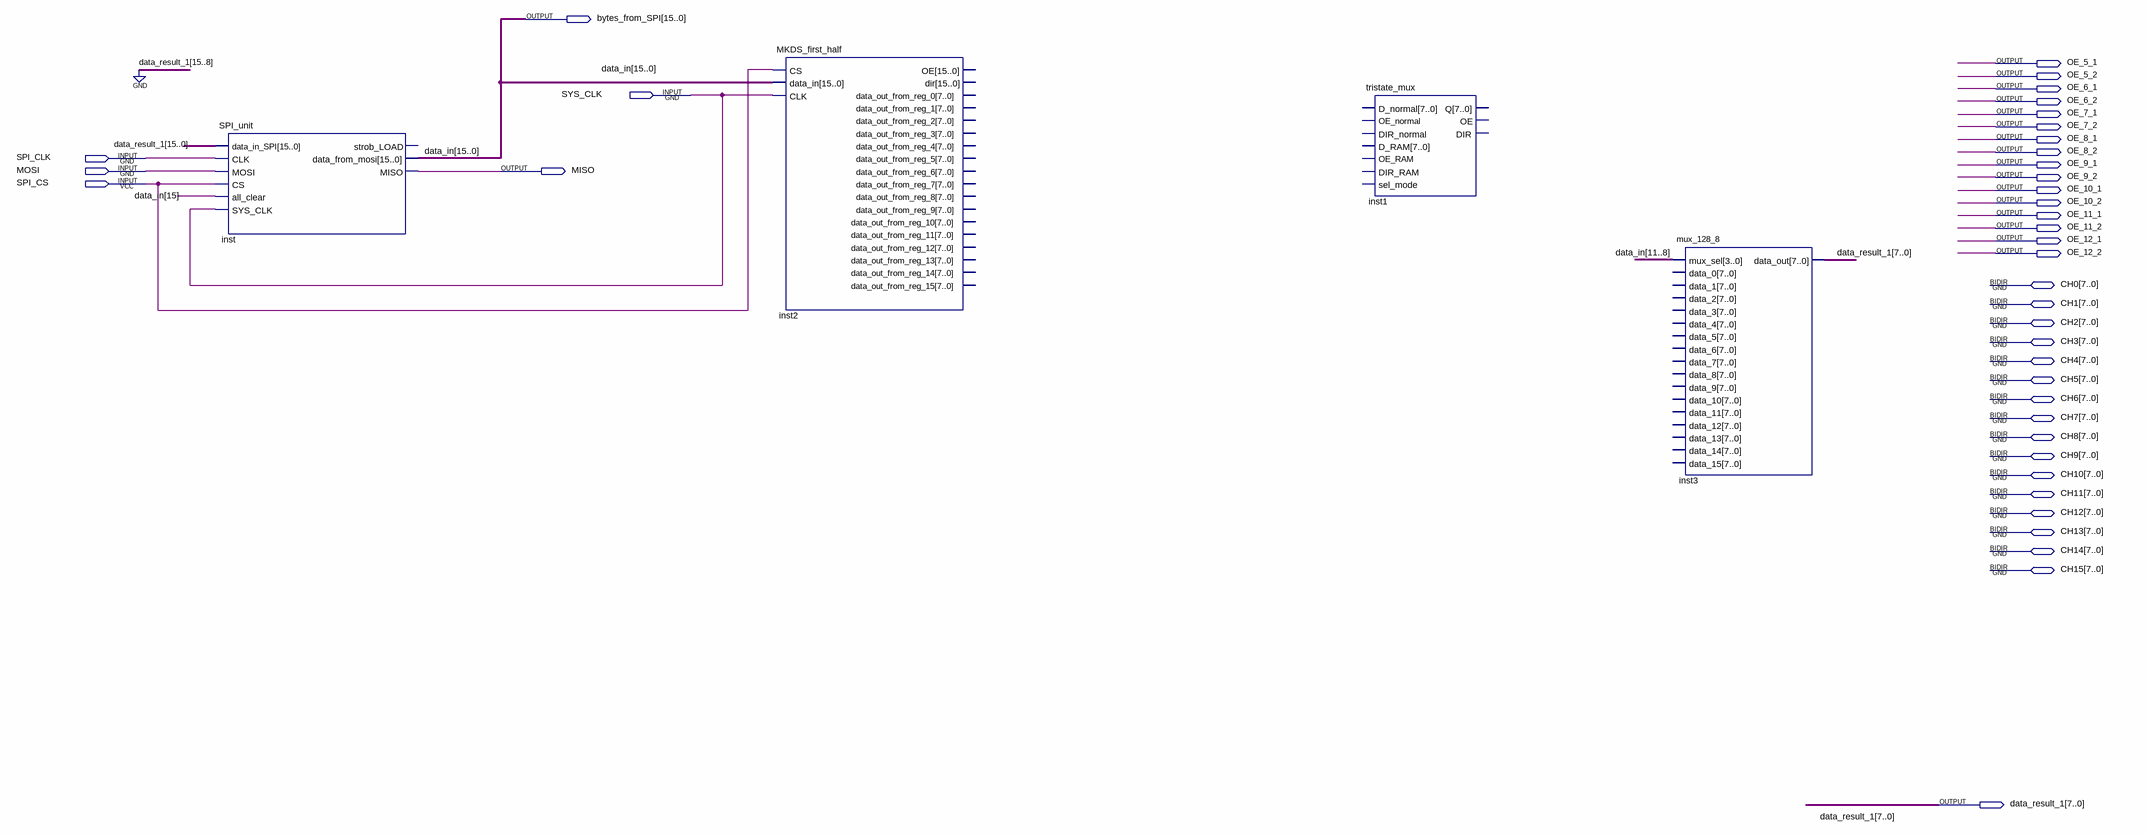
[diagram p0: schematic sheet]
// Quartus schematic General_block_diagram.bdf as structural Verilog: 4 symbols, 39 pins
module General_block_diagram (
  input  SYS_CLK,
  input  SPI_CLK,
  input  MOSI,
  input  SPI_CS,
  inout  [7:0] CH0,
  inout  [7:0] CH1,
  inout  [7:0] CH2,
  inout  [7:0] CH3,
  inout  [7:0] CH4,
  inout  [7:0] CH5,
  inout  [7:0] CH6,
  inout  [7:0] CH7,
  inout  [7:0] CH8,
  inout  [7:0] CH9,
  inout  [7:0] CH10,
  inout  [7:0] CH11,
  inout  [7:0] CH12,
  inout  [7:0] CH13,
  inout  [7:0] CH14,
  inout  [7:0] CH15,
  output [15:0] bytes_from_SPI,
  output OE_5_1,
  output OE_5_2,
  output OE_6_1,
  output OE_6_2,
  output OE_7_1,
  output OE_7_2,
  output OE_8_1,
  output OE_8_2,
  output OE_9_1,
  output MISO,
  output OE_9_2,
  output OE_10_1,
  output OE_10_2,
  output OE_11_1,
  output OE_11_2,
  output OE_12_1,
  output OE_12_2,
  output [7:0] data_result_1
);

  SPI_unit inst (
    .data_in_SPI({{8{1'b0}}, data_result_1}), .CLK(SPI_CLK), .MOSI(MOSI), .CS(SPI_CS),
    .all_clear(bytes_from_SPI[15]), .SYS_CLK(SYS_CLK), .data_from_mosi(bytes_from_SPI), .MISO(MISO));  // open: strob_LOAD
  MKDS_first_half inst2 (
    .CS(SPI_CS), .data_in(bytes_from_SPI), .CLK(SYS_CLK));  // open: OE, dir, data_out_from_reg_0, data_out_from_reg_1, data_out_from_reg_2, data_out_from_reg_3, data_out_from_reg_4, data_out_from_reg_5, data_out_from_reg_6, data_out_from_reg_7, data_out_from_reg_8, data_out_from_reg_9, data_out_from_reg_10, data_out_from_reg_11, data_out_from_reg_12, data_out_from_reg_13, data_out_from_reg_14, data_out_from_reg_15
  tristate_mux inst1 ();  // open: D_normal, OE_normal, DIR_normal, D_RAM, OE_RAM, DIR_RAM, sel_mode, Q, OE, DIR
  mux_128_8 inst3 (
    .mux_sel(bytes_from_SPI[11:8]), .data_out(data_result_1));  // open: data_0, data_1, data_2, data_3, data_4, data_5, data_6, data_7, data_8, data_9, data_10, data_11, data_12, data_13, data_14, data_15

  // Other names for the same wires on the sheet: data_in[15:0] = bytes_from_SPI
endmodule
